# Altium schematic sheet BANK2.SchDoc
size A4
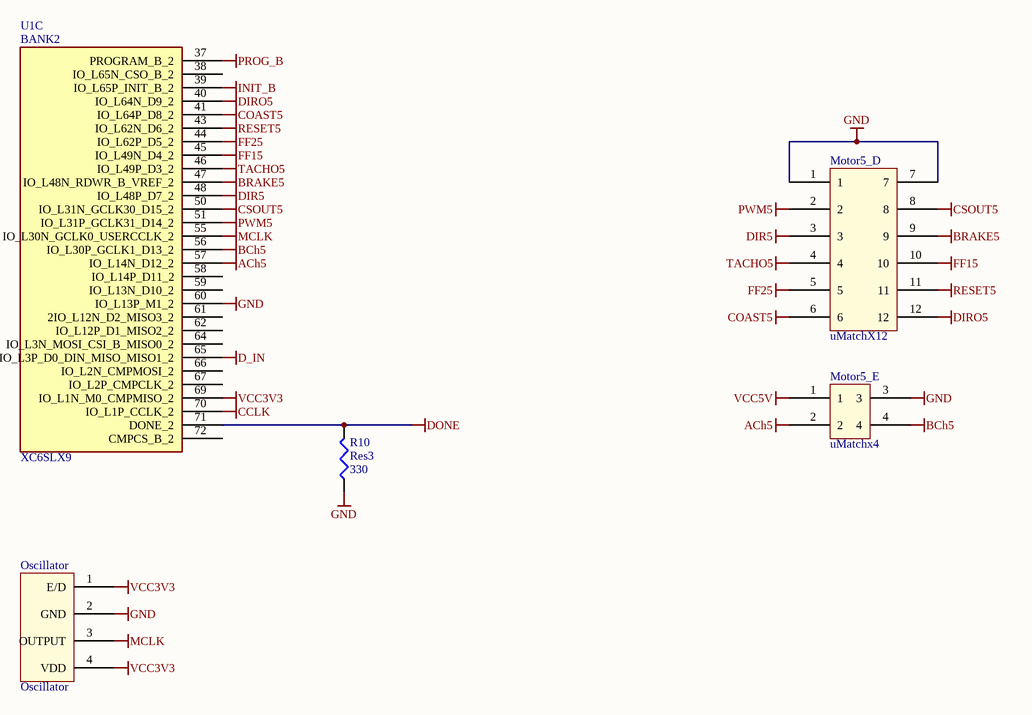
[diagram p0: BANK2.SchDoc]

## Parts
Motor5_D  uMatchX12  [uMatchX12]
Motor5_E  uMatchx4  [Micromatch x4]
Oscillator  Oscillator  [osc_FOOTPRINT]
R10  Res3  value 330  [J1-0603]
U1  XC6SLX9  [XC6SLX9]  (part C of 6)

## Nets
ACh5: Motor5_E.2 U1.57(IO_L14N_D12_2)
BCh5: Motor5_E.4 U1.56(IO_L30P_GCLK1_D13_2)
BRAKE5: Motor5_D.9 U1.47(IO_L48N_RDWR_B_VREF_2)
CCLK: U1.70(IO_L1P_CCLK_2)
COAST5: Motor5_D.6 U1.41(IO_L64P_D8_2)
CSOUT5: Motor5_D.8 U1.50(IO_L31N_GCLK30_D15_2)
D_IN: U1.65(IO_L3P_D0_DIN_MISO_MISO1_2)
DIR5: Motor5_D.3 U1.48(IO_L48P_D7_2)
DIRO5: Motor5_D.12 U1.40(IO_L64N_D9_2)
DONE: R10.2 U1.71(DONE_2)
FF15: Motor5_D.10 U1.45(IO_L49N_D4_2)
FF25: Motor5_D.5 U1.44(IO_L62P_D5_2)
GND: Motor5_D.1 Motor5_D.7 Motor5_E.3 Oscillator.2(GND) R10.1 U1.60(IO_L13P_M1_2)
INIT_B: U1.39(IO_L65P_INIT_B_2)
MCLK: Oscillator.3(OUTPUT) U1.55(IO_L30N_GCLK0_USERCCLK_2)
PROG_B: U1.37(PROGRAM_B_2)
PWM5: Motor5_D.2 U1.51(IO_L31P_GCLK31_D14_2)
RESET5: Motor5_D.11 U1.43(IO_L62N_D6_2)
TACHO5: Motor5_D.4 U1.46(IO_L49P_D3_2)
VCC3V3: Oscillator.1(E/D) Oscillator.4(VDD) U1.69(IO_L1N_M0_CMPMISO_2)
VCC5V: Motor5_E.1

Not connected (* = marked no-connect by the designer): U1 38(IO_L65N_CSO_B_2) 58(IO_L14P_D11_2) 59(IO_L13N_D10_2) 61(2IO_L12N_D2_MISO3_2) 62(IO_L12P_D1_MISO2_2) 64(IO_L3N_MOSI_CSI_B_MISO0_2) 66(IO_L2N_CMPMOSI_2) 67(IO_L2P_CMPCLK_2) 72(CMPCS_B_2)

## Notes on the sheet
- (in symbol C6SLX9, part C) BANK2

## Library data of the parts
Oscillator = Oscillator: Fox_osc_100MHz; Farnell: http://ee.farnell.com/fox-electronics/fxo-hc536r-33/osc-3-2x5mm-smd-cer-33-000mhz/dp/1641043?Ntt=1641043
R10 = Res3: Resistor; Published: 8-Jun-2000; LatestRevisionDate: 29-May-2009; LatestRevisionNote: IPC-7351 Footprint Added.; PackageReference: J1-0603; Publisher: Altium Limited; PackageDescription: Chip Resistor
U1 = C6SLX9: Imported; Farnell: http://ee.farnell.com/xilinx/xc6slx9-2tqg144c/fpga-spartan-6-lx-9k-144tqfp/dp/1876228